# Altium schematic sheet esp32_audio_sch.SchDoc
size A4
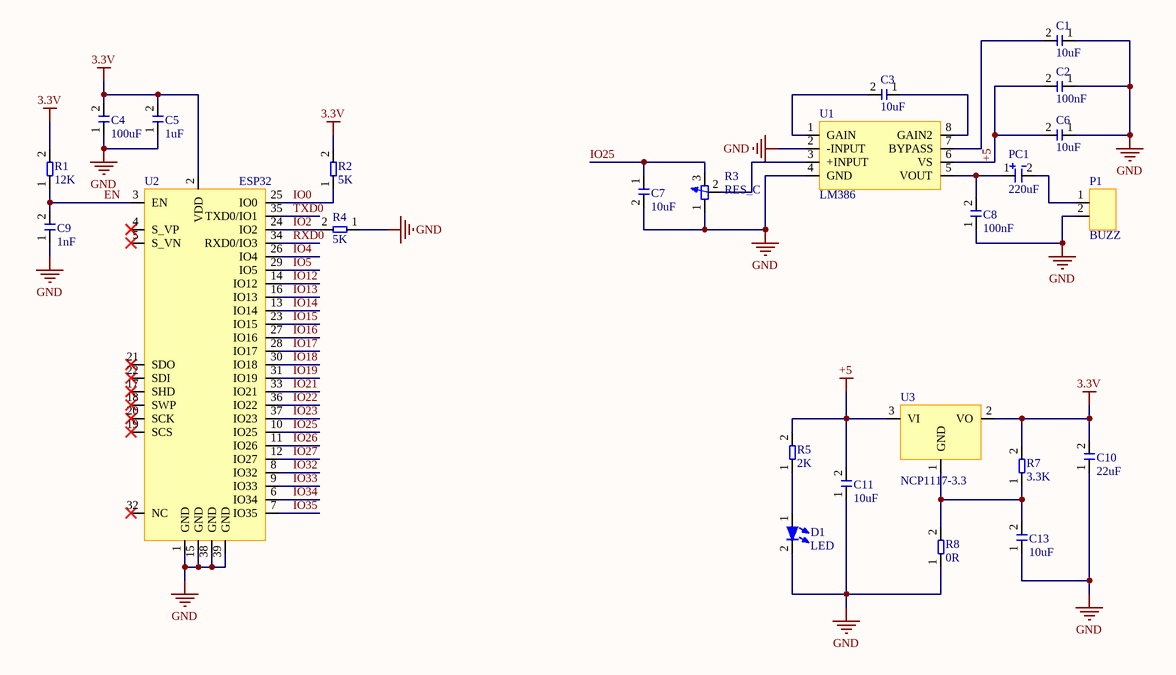
[diagram p0: esp32_audio_sch.SchDoc]

## Parts
C1  10uF  [0805]
C2  100nF  [0805]
C3  10uF  [0805]
C4  100uF  [3216A_CAP_TAN]
C5  1uF  [3216A_CAP_TAN]
C6  10uF  [0805]
C7  10uF  [0805]
C8  100nF  [0805]
C9  1nF  [CAP0805]
C10  22uF  [CAP0805]
C11  10uF  [CAP0805]
C13  10uF  [CAP0805]
D1  LED  [CAP0805]
P1  BUZZ  [BATTERY]
PC1  220uF  [DIOCAP]
R1  12K  [CAP0805]
R2  5K  [CAP0805]
R3  RES_C  [RES_C]
R4  5K  [CAP0805]
R5  2K  [CAP0805]
R7  3.3K  [CAP0805]
R8  0R  [CAP0805]
U1  LM386  [DIP_8_LM386]
U2  ESP32  [ESP32S]
U3  NCP1117-3.3  [NCP1117-33-SOT223]

## Nets
3.3V: C4.2 C5.2 C10.2 R1.2 R2.2 R7.2 U2.2(VDD) U3.2(VO)
+5: C2.2 C6.2 C11.2 R5.2 U1.6(VS) U3.3(VI)
GND: C1.1 C2.1 C4.1 C5.1 C6.1 C7.2 C8.1 C9.1 C10.1 C11.1 C13.1 D1.2 P1.2 R3.1 R4.1 R8.1 U1.2(-INPUT) U1.4(GND) U2.1(GND) U2.15(GND) U2.38(GND) U2.39(GND)
EN: C9.2 R1.1 U2.3(EN)
IO0: R2.1 U2.25(IO0)
IO2: R4.2 U2.24(IO2)
IO4: U2.26(IO4)
IO5: U2.29(IO5)
IO12: U2.14(IO12)
IO13: U2.16(IO13)
IO14: U2.13(IO14)
IO15: U2.23(IO15)
IO16: U2.27(IO16)
IO17: U2.28(IO17)
IO18: U2.30(IO18)
IO19: U2.31(IO19)
IO21: U2.33(IO21)
IO22: U2.36(IO22)
IO23: U2.37(IO23)
IO25: C7.1 R3.3 U2.10(IO25)
IO26: U2.11(IO26)
IO27: U2.12(IO27)
IO32: U2.8(IO32)
IO33: U2.9(IO33)
IO34: U2.6(IO34)
IO35: U2.7(IO35)
RXD0: U2.34(RXD0/IO3)
TXD0: U2.35(TXD0/IO1)
NetC1_2: C1.2 U1.7(BYPASS)
NetC3_1: C3.1 U1.8(GAIN2)
NetC3_2: C3.2 U1.1(GAIN)
NetC8_2: C8.2 PC1.1 U1.5(VOUT)
NetC13_2: C13.2 R7.1 R8.2 U3.1(GND)
NetD1_1: D1.1 R5.1
NetP1_1: P1.1 PC1.2
NetR3_2: R3.2 U1.3(+INPUT)

Not connected (* = marked no-connect by the designer): U2 4(S_VP)* 5(S_VN)* 17(SHD)* 18(SWP)* 19(SCS)* 20(SCK)* 21(SDO)* 22(SDI)* 32(NC)*

## Library data of the parts
C1-C11 C13 = CAP: 电容
PC1 = PCAP: 极性电容
R1 R2 R4 R5 R7 R8 = RES: 电阻
U3 = NCP1117-3.3: NCP1117-3.3-SOT223